# Altium schematic sheet dianji.SchDoc
size A4
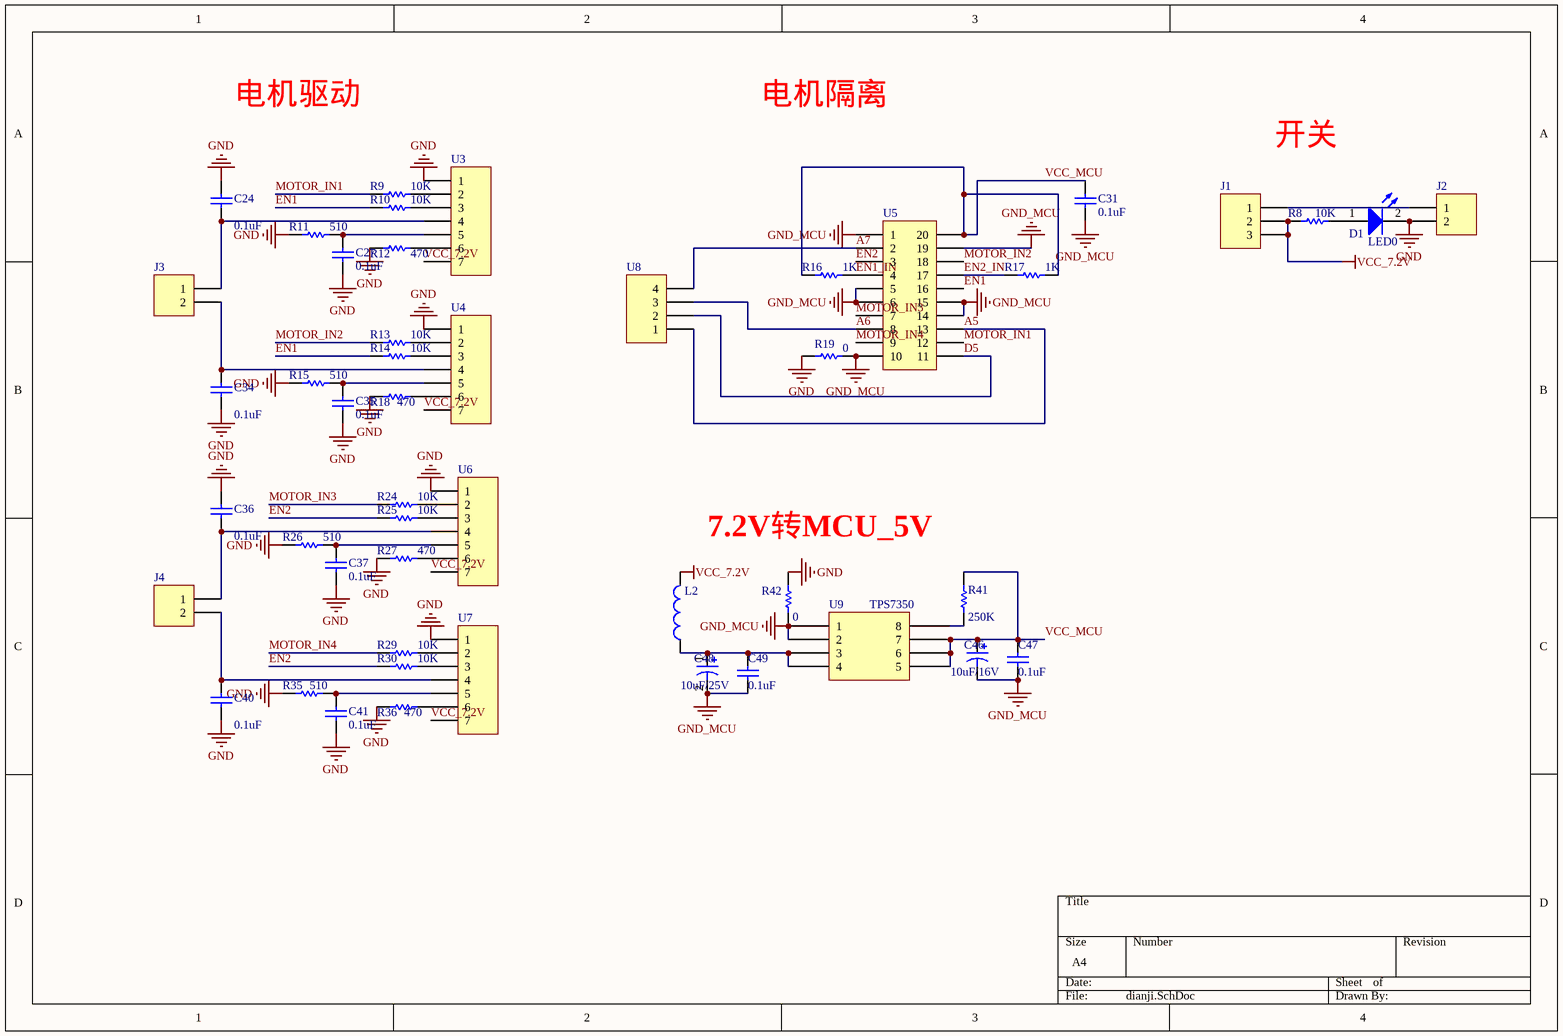
[diagram p0: dianji.SchDoc]

## Parts
C24  0.1uF  [C0805]
C27  0.1uF  [C0805]
C31  0.1uF  [C0805]
C34  0.1uF  [C0805]
C35  0.1uF  [C0805]
C36  0.1uF  [C0805]
C37  0.1uF  [C0805]
C40  0.1uF  [C0805]
C41  0.1uF  [C0805]
C46  10uF/16V  [C1206]
C47  0.1uF  [C0805]
C48  10uF/25V  [C1206]
C49  0.1uF  [C0805]
D1  LED0  [d0603]
J1  Header 3  [7.2]  (value not drawn)
J2  Header 2  [PCBComponent_1 - duplicate5]  (value not drawn)
J3  Header 2  [1]  (value not drawn)
J4  Header 2  [1]  (value not drawn)
L2  (no value)  [L0805]
R8  value 10K  [R0805]  (hidden comment: Res1)
R9  10K  [R0805]
R10  10K  [R0805]
R11  value 510  [R0805]  (hidden comment: 510R)
R12  value 470  [R0805]  (hidden comment: 470R)
R13  10K  [R0805]
R14  value 10K  [R0805]  (hidden comment: Res1)
R15  value 510  [R0805]  (hidden comment: 510R)
R16  1K  [R0805]
R17  1K  [R0805]
R18  value 470  [R0805]  (hidden comment: 470R)
R19  0  [R0805]
R24  10K  [R0805]
R25  10K  [R0805]
R26  value 510  [R0805]  (hidden comment: 510R)
R27  value 470  [R0805]  (hidden comment: 470R)
R29  10K  [R0805]
R30  10K  [R0805]
R35  value 510  [R0805]  (hidden comment: 510R)
R36  value 470  [R0805]  (hidden comment: 470R)
R41  250K  [R0805]
R42  0  [R0805]
U3  Header 7  [BST7970]  (value not drawn)
U4  Header 7  [BST7970]  (value not drawn)
U5  Header 10X2  [xin]  (value not drawn)
U6  Header 7  [BST7970]  (value not drawn)
U7  Header 7  [BST7970]  (value not drawn)
U8  Header 4  [SIP4]  (value not drawn)
U9  TPS7350  [sop8]

## Nets
GND: C24.2 C27.1 C34.1 C35.1 C36.2 C37.1 C40.1 C41.1 D1.2(K) J2.2 R11.1 R12.1 R15.1 R18.1 R19.1 R26.1 R27.1 R35.1 R36.1 R42.2 U3.1 U4.1 U6.1 U7.1
GND_MCU: C31.1 C46.2 C47.1 C48.2 C49.1 R19.2 R42.1 U5.1 U5.5 U5.6 U5.10 U5.14 U5.15 U5.19 U9.1 U9.2
VCC_7.2V: J1.2 J1.3 L2.2 R8.1 U3.7 U4.7 U6.7 U7.7
A5: U5.13 U8.1
A6: U5.8 U8.3
A7: U5.2 U8.4
D5: U5.11 U8.2
EN1: R10.1 R14.1 U5.16
EN1_IN: R16.1 U5.4
EN2: R25.1 R30.1 U5.3
EN2_IN: R17.2 U5.17
MOTOR_IN1: R9.1 U5.12
MOTOR_IN2: R13.1 U5.18
MOTOR_IN3: R24.1 U5.7
MOTOR_IN4: R29.1 U5.9
VCC_MCU: C31.2 C46.1 C47.2 R16.2 R17.1 R41.2 U5.20 U9.5 U9.6 U9.7
NetC24_1: C24.1 J3.1 U3.4
NetC27_2: C27.2 R11.2 U3.5
NetC34_2: C34.2 J3.2 U4.4
NetC35_2: C35.2 R15.2 U4.5
NetC36_1: C36.1 J4.1 U6.4
NetC37_2: C37.2 R26.2 U6.5
NetC40_2: C40.2 J4.2 U7.4
NetC41_2: C41.2 R35.2 U7.5
NetC48_1: C48.1 C49.2 L2.1 U9.3 U9.4
NetD1_1: D1.1(A) R8.2
NetJ1_1: J1.1 J2.1
NetR9_2: R9.2 U3.2
NetR10_2: R10.2 U3.3
NetR12_2: R12.2 U3.6
NetR13_2: R13.2 U4.2
NetR14_2: R14.2 U4.3
NetR18_2: R18.2 U4.6
NetR24_2: R24.2 U6.2
NetR25_2: R25.2 U6.3
NetR27_2: R27.2 U6.6
NetR29_2: R29.2 U7.2
NetR30_2: R30.2 U7.3
NetR36_2: R36.2 U7.6
NetR41_1: R41.1 U9.8

## Notes on the sheet
- 电机驱动
- 电机隔离
- 开关
- 7.2V转MCU_5V

## Library data of the parts
C24 C27 C31 C34-C37 C40 C41 C47 C49 = Cap: Capacitor; Published: 8-Jun-2000; LatestRevisionDate: 17-Jul-2002; LatestRevisionNote: Re-released for DXP Platform.; PackageReference: RAD-0.3; Publisher: Altium Limited; PackageDescription: Radial Cap, Thru-Hole; 2 Leads; 0.3 in Pin Spacing; Value: 0.1uF
C46 C48 = Cap Pol1: Polarized Capacitor (Radial); Published: 8-Jun-2000; LatestRevisionDate: 17-Jul-2002; LatestRevisionNote: Re-released for DXP Platform.; PackageReference: RB7.6-15; Publisher: Altium Limited; PackageDescription: Polarized Capacitor (Radial); 2 Leads
  C46: Value: 10uF/16V
  C48: Value: 10uF/25V
D1 = LED0: Typical INFRARED GaAs LED; Published: 8-Jun-2000; LatestRevisionDate: 08-Jul-2005; LatestRevisionNote: Mech Layer 1 removed.; PackageReference: LED-0; Publisher: Altium Limited; PackageDescription: LED; 2 Leads
J1 = Header 3: Header, 3-Pin; LatestRevisionDate: 17-Jul-2002; LatestRevisionNote: Re-released for DXP Platform.; Publisher: Altium Limited
J2-J4 = Header 2: Header, 2-Pin; LatestRevisionDate: 17-Jul-2002; LatestRevisionNote: Re-released for DXP Platform.; Publisher: Altium Limited
L2 = Inductor: Code_IEC: 1005; Value: 10mH; Published: 8-Jun-2000; LatestRevisionDate: 29-May-2009; LatestRevisionNote: IPC-7351 Footprint Added.; PackageReference: 0402-A; Publisher: Altium Limited; PackageDescription: Chip Inductor; Code_JEITA: 0402
R8-R19 R24-R27 R29 R30 R35 R36 R41 R42 = Res1: Resistor; Published: 8-Jun-2000; LatestRevisionDate: 17-Jul-2002; LatestRevisionNote: Re-released for DXP Platform.; PackageReference: AXIAL-0.3; Publisher: Altium Limited; PackageDescription: Axial Device, Thru-Hole; 2 Leads; 0.3 in Pin Spacing
  R9 R10 R13 R24 R25 R29 R30: Value: 10K
  R16 R17: Value: 1K
  R19 R42: Value: 0
  R41: Value: 250K
U3 U4 U6 U7 = Header 7: Header, 7-Pin; LatestRevisionDate: 17-Jul-2002; LatestRevisionNote: Re-released for DXP Platform.; Publisher: Altium Limited
U5 = Header 10X2: Header, 10-Pin, Dual row; LatestRevisionDate: 17-Jul-2002; LatestRevisionNote: Re-released for DXP Platform.; Publisher: Altium Limited
U8 = Header 4: Header, 4-Pin; LatestRevisionDate: 17-Jul-2002; LatestRevisionNote: Re-released for DXP Platform.; Publisher: Altium Limited
U9 = Component_1